# Altium schematic sheet Hall_sensor.SchDoc
size A4
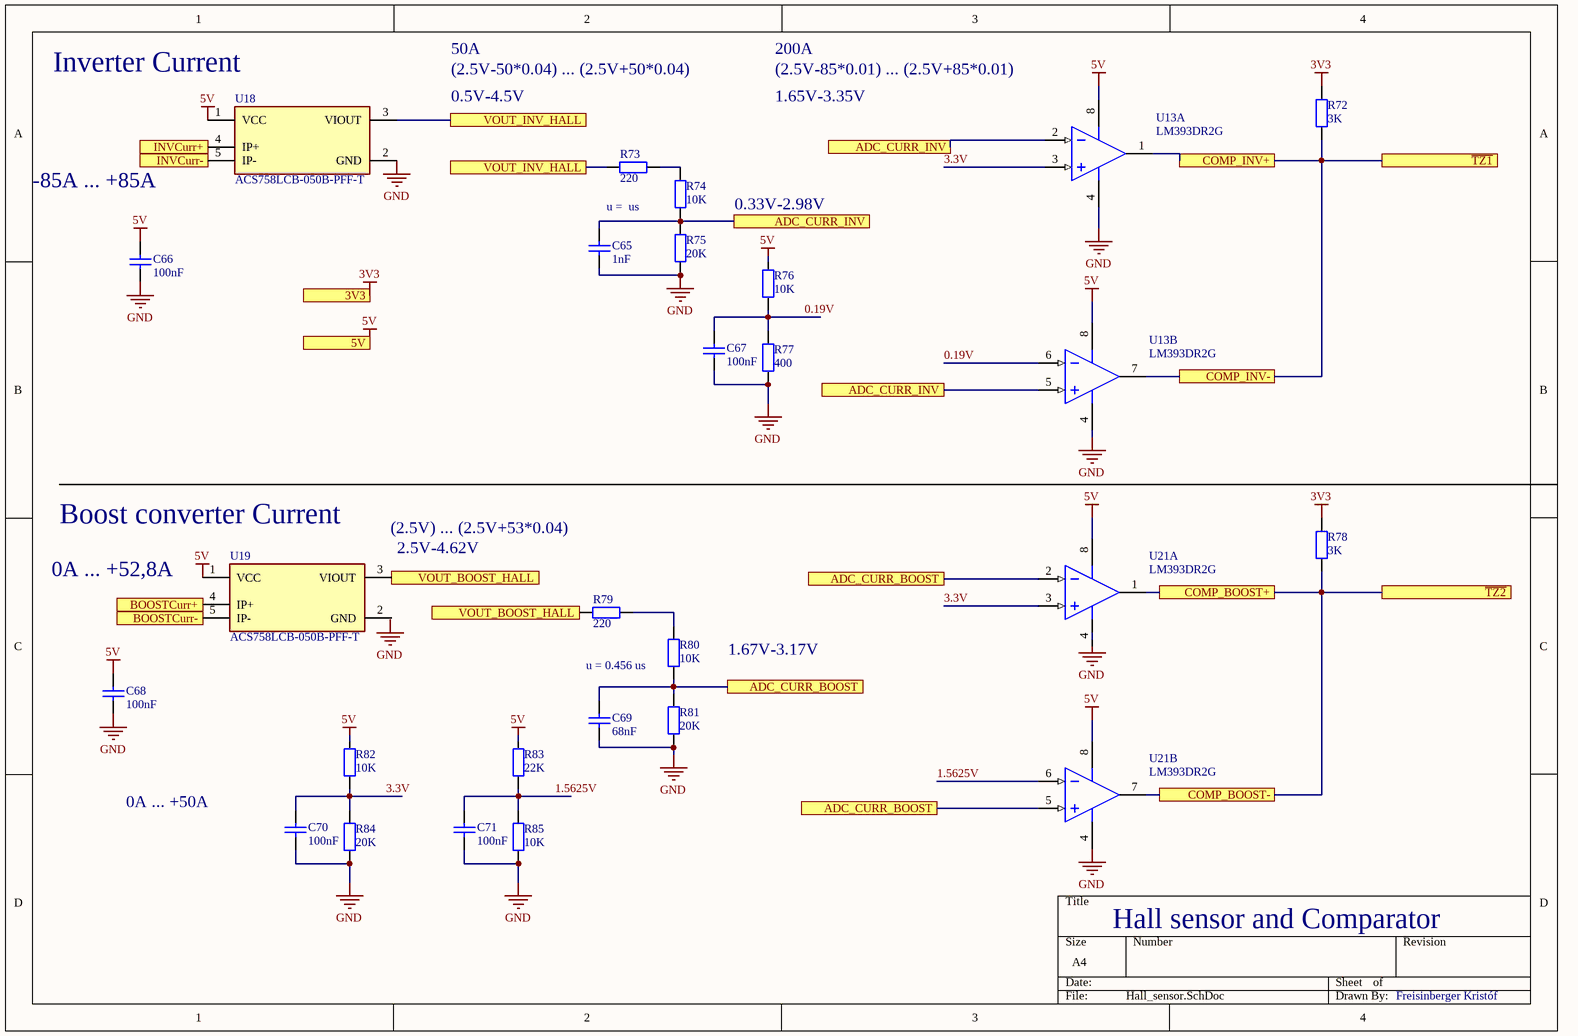
[diagram p0: Hall_sensor.SchDoc]

## Parts
C65  1nF  [FP_0805_CAP_085]
C66  100nF  [FP_0805_CAP_085]
C67  100nF  [FP_0805_CAP_085]
C68  100nF  [FP_0805_CAP_085]
C69  68nF  [FP_0805_CAP_085]
C70  100nF  [FP_0805_CAP_085]
C71  100nF  [FP_0805_CAP_085]
R72  3K  [FP_0805_RES]
R73  220  [FP_0805_RES]
R74  10K  [FP_0805_RES]
R75  20K  [FP_0805_RES]
R76  10K  [FP_0805_RES]
R77  400  [FP_0805_RES]
R78  3K  [FP_0805_RES]
R79  220  [FP_0805_RES]
R80  10K  [FP_0805_RES]
R81  20K  [FP_0805_RES]
R82  10K  [FP_0805_RES]
R83  22K  [FP_0805_RES]
R84  20K  [FP_0805_RES]
R85  10K  [FP_0805_RES]
U13  LM393DR2G  [ONSC-SOIC-8-751-07_V]  (parts A,B of 2)
U18  ACS758LCB-050B-PFF-T  [FP-CB-5-PFF-MFG]
U19  ACS758LCB-050B-PFF-T  [FP-CB-5-PFF-MFG]
U21  LM393DR2G  [ONSC-SOIC-8-751-07_V]  (parts A,B of 2)

## Ports
3V3, 5V, ADC_CURR_BOOST, ADC_CURR_INV, BOOSTCurr+, BOOSTCurr-, COMP_BOOST+, COMP_BOOST-, COMP_INV+, COMP_INV-, INVCurr+, INVCurr-, VOUT_BOOST_HALL, VOUT_INV_HALL, ~{TZ1}, ~{TZ2}

## Nets
3V3: R72.2 R78.2 ; port 3V3
5V: C66.1 C68.1 R76.1 R82.1 R83.1 U13.8(VCC) U18.1(VCC) U19.1(VCC) U21.8(VCC) ; port 5V
GND: C65.2 C66.2 C67.2 C68.2 C69.2 C70.2 C71.2 R75.1 R77.2 R81.2 R84.2 R85.2 U13.4(GND) U18.2(GND) U21.4(GND)
0.19V: C67.1 R76.2 R77.1 U13.6(INB-)
1.5625V: C71.1 R83.2 R85.1 U21.6(INB-)
3.3V: C70.1 R82.2 R84.1 U13.3(INA+) U21.3(INA+)
ADC_CURR_BOOST: C69.1 R80.2 R81.1 U21.2(INA-) U21.5(INB+) ; port ADC_CURR_BOOST
ADC_CURR_INV: C65.1 R74.2 R75.2 U13.2(INA-) U13.5(INB+) ; port ADC_CURR_INV
BOOSTCurr+: U19.4(IP+) ; port BOOSTCurr+
BOOSTCurr-: U19.5(IP-) ; port BOOSTCurr-
COMP_BOOST+: R78.1 U21.1(OUTA) U21.7(OUTB) ; port COMP_BOOST+, port COMP_BOOST-, port ~{TZ2}
COMP_INV+: R72.1 U13.1(OUTA) U13.7(OUTB) ; port COMP_INV+, port COMP_INV-, port ~{TZ1}
INVCurr+: U18.4(IP+) ; port INVCurr+
INVCurr-: U18.5(IP-) ; port INVCurr-
VOUT_BOOST_HALL: R79.2 U19.3(VIOUT) ; port VOUT_BOOST_HALL
VOUT_INV_HALL: R73.1 U18.3(VIOUT) ; port VOUT_INV_HALL
NetR73_2: R73.2 R74.1
NetR79_1: R79.1 R80.1

Not connected (* = marked no-connect by the designer): U19 2(GND)

## Notes on the sheet
- (near U18) Inverter Current
- (2.5V-50*0.04) ... (2.5V+50*0.04)
- 0.5V-4.5V
- 50A
- (near U13) (2.5V-85*0.01) ... (2.5V+85*0.01)
- 1.65V-3.35V
- 200A
- -85A ... +85A
- u =  us
- 0.33V-2.98V
- (near U19) 0A ... +52,8A
- (near U19) Boost converter Current
- (2.5V) ... (2.5V+53*0.04)
- (near U19) 2.5V-4.62V
- 1.67V-3.17V
- (near R80) u = 0.456 us
- 0A ... +50A
- Hall sensor and Comparator
- Freisinberger Kristóf
- Labels drawn without touching a wire or pin: GND

## Library data of the parts
C65-C71 = CAP: Capacitor
  C65: Value: 1nF
  C66-C68 C70 C71: Value: 100nF
  C69: Value: 68nF
R72-R85 = RES: Resistor
  R72 R78: Value: 3K
  R73 R79: Value: 220
  R74 R76 R80 R82 R85: Value: 10K
  R75 R81 R84: Value: 20K
  R77: Value: 400
  R83: Value: 22K
U13 U21 = CMP-1305-00048-1: Low Offset Voltage Dual Comparators, 2 to 36 V, 0 to 70 degC, 8-Pin SOIC, Pb-Free, Tape and Reel; Manufacturer: On Semiconductor; VCC Min (V): 2; VCC Max (V): 36; ICC Typ (mA): 0.4; IO Typ (mA): 16; ComponentLink1Description: Manufacturer URL; ComponentLink2Description: Datasheet; Packing: Tape and Reel; PackageVersion: Rev. AK, 02/2011; RoHS: TRUE; Mounting Technology: Surface Mount; ComponentLink3URL: http://www.onsemi.com/pub_link/Collateral/751-07.PDF; PackageReference: SOIC-8-751-07; PackageDescription: 8-Pin Small Outline Integrated Circuit, Body 4.9 x 3.9 mm, Pitch 1.27 mm; ComponentLink3Description: Package Specification; ComponentLink1URL: http://www.onsemi.com/; PartNumber: LM393DR2G; DatasheetVersion: Rev. 25; ComponentLink2URL: http://www.onsemi.com/pub_link/Collateral/LM393-D.PDF
U18 U19 = ACS758LCB-CMP-82923-000254-1: SENSOR CURRENT HALL 50A AC/DC; Operating Supply Voltage: 5V; Max Supply Current: 13.5mA; Frequency: 120kHz; Quiescent Current: 10mA; Response Time: 4us; Sensitivity: 40mV/A; Output Current: 1mA; Linearity: 1%; Polarity: Bidirectional; Accuracy: 2%; Number of Channels: 1; Max Supply Voltage: 5.5V; Min Supply Voltage: 3V; Radiation Hardening: No; Packaging: Rail/Tube; Length: 10mm; Height: 7mm; Lead Free: Lead Free; Current Sensing: 50A; Number of Pins: 5; Min Operating Temperature: -40°C; RoHS Compliant: Yes; REACH SVHC: No SVHC; Max Operating Temperature: 150°C; Package Quantity: 34; Bandwidth: 120kHz; Mount: Through Hole; Width: 13mm; Series: -